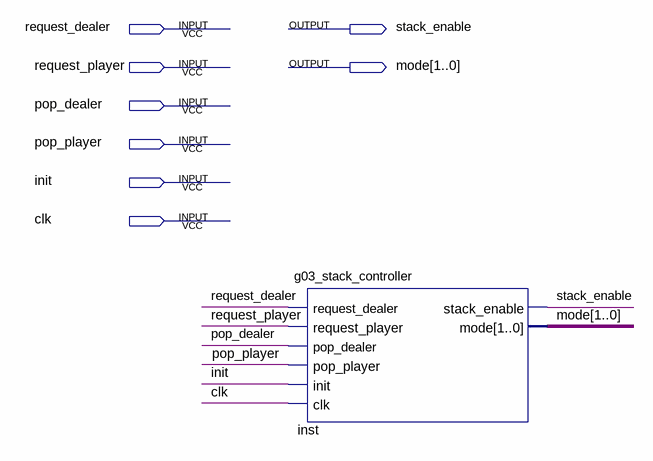
[diagram p0: schematic sheet]
// Quartus schematic g03_stack_controller_test.bdf as structural Verilog: 1 symbols, 8 pins
module g03_stack_controller_test (
  input  request_dealer,
  input  request_player,
  input  pop_dealer,
  input  pop_player,
  input  init,
  input  clk,
  output stack_enable,
  output [1:0] mode
);

  g03_stack_controller inst (
    .request_dealer(request_dealer), .request_player(request_player), .pop_dealer(pop_dealer),
    .pop_player(pop_player), .init(init), .clk(clk), .stack_enable(stack_enable), .mode(mode));
endmodule
